# Altium schematic sheet ECG_PWR_MGMT.SchDoc: ECG power mgmt
size 420 x 297 mm; Author: Senuda Rathnayake; SheetNumber: 1; SheetTotal: 6
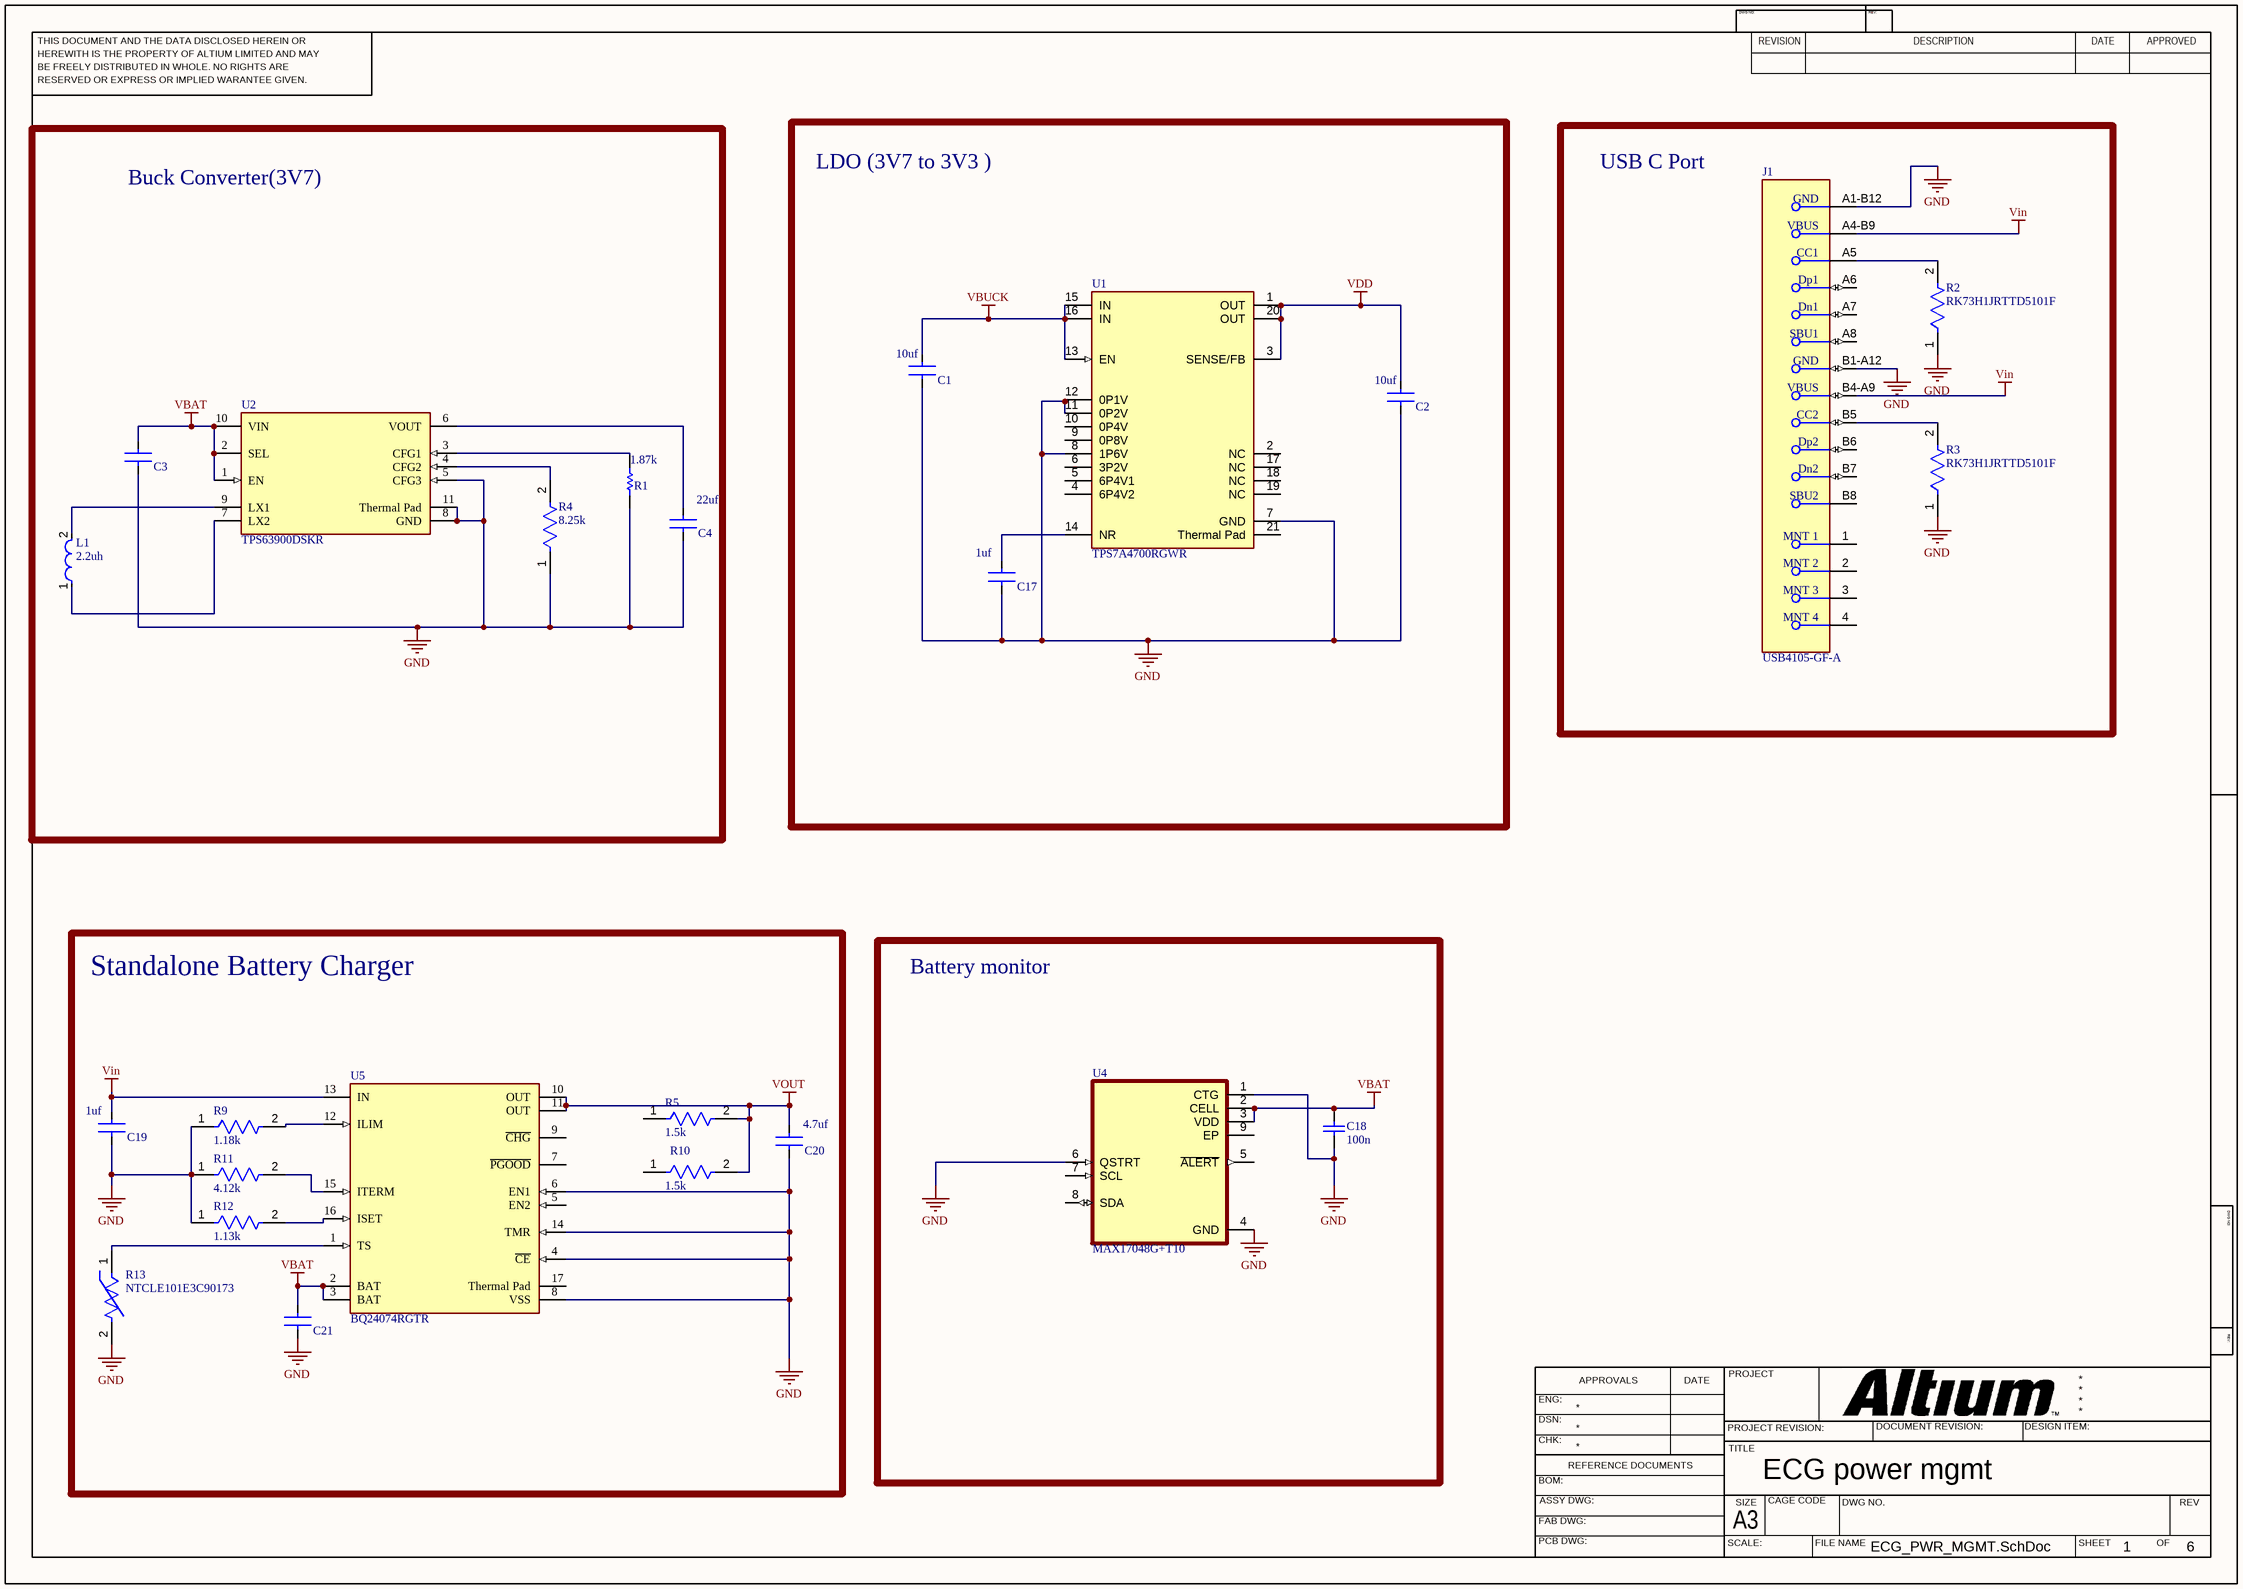
[diagram p0: ECG_PWR_MGMT.SchDoc]

## Parts
C1  10uf
C2  10uf
C3  Template for SMD cap  (value not drawn)
C4  22uf
C17  1uf
C18  100n  [CAP_SMD_0603_IPC_A]
C19  1uf
C20  4.7uf
C21  Template for SMD cap  (value not drawn)
J1  USB4105-GF-A  [FP-USB4105-GF-A-MFG]
L1  2.2uh  [FP-LQM2HPN_G0-IPC_C]
R1  1.87k  [RESC2013X60X35ML10T20]
R2  RK73H1JRTTD5101F  [FP-RK73H1J-IPC_C]
R3  RK73H1JRTTD5101F  [FP-RK73H1J-IPC_C]
R4  8.25k  [FP-MCT0603-IPC_B]
R5  1.5k  [FP-MCT0603-IPC_B]
R9  1.18k  [FP-MCT0603-IPC_B]
R10  1.5k  [FP-MCT0603-IPC_B]
R11  4.12k  [FP-MCT0603-IPC_B]
R12  1.13k  [FP-MCT0603-IPC_B]
R13  NTCLE101E3C90173  [FP-NTCLE101E3C90173-MFG]
U1  TPS7A4700RGWR  [FP-RGW0020A-MFG]
U2  TPS63900DSKR  [FP-DSK0010A-IPC_C]
U4  MAX17048G+T10  [max17048g+t10]
U5  BQ24074RGTR  [FP-RGT0016C-IPC_B]

## Blocks framed on the sheet
Buck Converter(3V7): C3 C4 L1 R1 R4 U2
LDO (3V7 to 3V3 ): C1 C2 C17 U1
USB C Port: J1 R2 R3
Standalone Battery Charger: C19-C21 R5 R9-R13 U5
Battery monitor: C18 U4

## Nets
GND: C1.1 C2.1 C3.1 C4.1 C17.1 C18.1 C19.1 C20.1 C21.1 J1.A1-B12(GND) J1.B1-A12(GND) R1.1 R2.1 R3.1 R4.1 R9.1 R11.1 R12.1 R13.2 U1.7(GND) U1.8(1P6V) U1.11(0P2V) U1.12(0P1V) U2.5(CFG3) U2.8(GND) U2.11(Thermal_Pad) U4.1(CTG) U4.4(GND) U4.6(QSTRT) U5.4(~{CE}) U5.6(EN1) U5.8(VSS) U5.14(TMR)
VBAT: C3.2 C18.2 C21.2 U2.1(EN) U2.2(SEL) U2.10(VIN) U4.2(CELL) U4.3(VDD) U5.2(BAT) U5.3(BAT)
VBUCK: C1.2 U1.13(EN) U1.15(IN) U1.16(IN)
VDD: C2.2 U1.1(OUT) U1.3(SENSE/FB) U1.20(OUT)
Vin: C19.2 J1.A4-B9(VBUS) J1.B4-A9(VBUS) U5.13(IN)
VOUT: C20.2 R5.2 R10.2 U5.10(OUT) U5.11(OUT)
NetC4_2: C4.2 U2.6(VOUT)
NetC17_2: C17.2 U1.14(NR)
NetJ1_A5: J1.A5(CC1) R2.2
NetJ1_B5: J1.B5(CC2) R3.2
NetL1_1: L1.1 U2.7(LX2)
NetL1_2: L1.2 U2.9(LX1)
NetR1_2: R1.2 U2.3(CFG1)
NetR4_2: R4.2 U2.4(CFG2)
NetR9_2: R9.2 U5.12(ILIM)
NetR11_2: R11.2 U5.15(ITERM)
NetR12_2: R12.2 U5.16(ISET)
NetR13_1: R13.1 U5.1(TS)

Not connected (* = marked no-connect by the designer): J1 1(MNT_1) 2(MNT_2) 3(MNT_3) 4(MNT_4) A6(Dp1) A7(Dn1) A8(SBU1) B6(Dp2) B7(Dn2) B8(SBU2); R5 1; R10 1; U1 2(NC) 4(6P4V2) 5(6P4V1) 6(3P2V) 9(0P8V) 10(0P4V) 17(NC) 18(NC) 19(NC) 21(Thermal_Pad); U4 5(~{ALERT}) 7(SCL) 8(SDA) 9(EP); U5 5(EN2) 7(~{PGOOD}) 9(~{CHG}) 17(Thermal_Pad)

## Notes on the sheet
- THIS DOCUMENT AND THE DATA DISCLOSED HEREIN OR
- HEREWITH IS THE PROPERTY OF ALTIUM LIMITED AND MAY
- DWG NO:
- REVISION
- REV:
- DESCRIPTION
- DATE
- APPROVED
- BE FREELY DISTRIBUTED IN WHOLE. NO RIGHTS ARE
- RESERVED OR EXPRESS OR IMPLIED WARANTEE GIVEN.
- ENG:
- APPROVALS
- PROJECT
- DSN:
- CHK:
- REFERENCE DOCUMENTS
- PROJECT REVISION:
- TITLE
- DOCUMENT REVISION:
- DESIGN ITEM:
- BOM:
- FAB DWG:
- PCB DWG:
- ASSY DWG:
- SCALE:
- A3
- SIZE
- CAGE CODE
- FILE NAME
- DWG NO.
- SHEET
- OF
- REV

## Library data of the parts
C1-C4 C17 C19-C21 = CAP-0805-16V-SMD-IPC_A
C18 = CAP-0603-16V-SMD: Manufacturer: AVX Interconnect / Elco; Part Number: 0603ZC103MAT2A
J1 = CMP-245163-000001-1: CONN RCPT USB2.0 TYPEC 5A; Manufacturer: GCT; Voltage Rating: 20V; Is Female: yes; Current Rating: 5/6.25/1.25/0.25A; Number Of Contacts: 16; Conn Orientation: Right Angle; Device Class L1: Connectors; Category: Conn; Lead Free: Yes; RoHS: TRUE; Temperature Range High: +85°C; Digikey Description: CONN RCPT USB2.0 TYPEC 5A; Device Class L3: unset; ComponentLink2Description: Datasheet; Manufacturer Part Number: USB4105-GF-A; Package: 0; Usb Standard: USB 2.0; Device Class L2: USB Connectors; Automotive: No; Temperature Range Low: -40°C; Height: 3.46mm; Temperature: -40°C to +85°C; Contact Material: Gold,Nickel; ComponentLink2URL: https://gct.co/files/drawings/usb4105.pdf; Octopart: https://octopart.com/usb4105-gf-a-gct-106627878
L1 = CMP-1662-00028-2: Multilayer Type Inductor for Power Lines, 1008 (2520), 2.2μH, 20%, 0.1Ω, 1.3A; Core Material: Ferrite; DC Resistance (DCR): 100mR; Test Frequency: 1MHz; Self Resonant Frequency: 40MHz; Shielding: Shielded; Depth: 2.2mm; Length: 2.5mm; Max DC Current: 1.3A; Military Standard: Not; Current Rating: 1.3A; Termination: SMD/SMT; Radiation Hardening: No; Tolerance: 20%; Height: 1.2mm; Case Code (Metric): 2520; DC Current: 1.3A; Inductance Tolerance: 20%; Packaging: Tape and Reel; Width: 2mm; REACH SVHC: No SVHC; Mount: Surface Mount; Inductance: 2.2uH; Max Operating Temperature: 125°C; Lead Free: Lead Free; Case/Package: 1008; Case Code (Imperial): 1008; Series: LQM2HP_G0; Height - Seated (Max): 0.039inch; Package Quantity: 3000; Min Operating Temperature: -55°C
R1 = 1K 0805
R2 R3 = CMP-04015-097718-1: 5.1kΩ ±1% 0.1W Chip Resistor 0603 Flat Chip (Anti-Sulfuration) AEC-Q200 Qualified; Power Rating: 100mW; Resistance: 5.1kR; Temperature Coefficient: 100ppm/°C; Voltage Rating: 75V; Packaging: Tape and Reel; Case/Package: 0603; Package Quantity: 5000; Min Operating Temperature: -55°C; Length: 1.6mm; Case Code (Metric): 1608; Tolerance: 1%; Width: 0.8mm; Termination: SMD/SMT; RoHS Compliant: Yes; Height: 0.45mm; Case Code (Imperial): 0603; Max Operating Temperature: 155°C; Weight: 7.1E-05oz
R4 R5 R9-R12 = CMP-02407-009826-1: RES SMD 100 OHM 1% 1/8W 0603; Resistance: 1.5kR; Temperature Coefficient: 25ppm/°C; Max Power Dissipation: 100mW; Voltage Rating (DC): 50V; Composition: Thin Film; Contact Plating: Tin; Lead Free: Lead Free; Length: 1.55mm; Packaging: Tape and Reel; Width: 0.033inch; Number of Terminations: 2; Case/Package: 0603; Height: 0.022inch; Mount: Surface Mount; Min Operating Temperature: -55°C; Package Quantity: 1000; Radiation Hardening: No; Power Rating: 100mW; Max Operating Temperature: 125°C; Military Standard: Not; Depth: 0.85mm
R13 = CMP-02404-000013-1: THERM NTC 10KOHM 3435K RADIAL; Max Power Dissipation: 250mW; Tolerance: 1%; Packaging: Bulk; Case/Package: Radial; Min Operating Temperature: -40°C; RoHS Compliant: Yes; Mount: Through Hole; Max Operating Temperature: 125°C
U1 = CMP-04917-000027-1: IC REG LINEAR POS ADJ 1A 20VQFN; Manufacturer: Texas Instruments; Output Type: AdjustableProgrammable; Output Voltage: 1.4-20.5V; Nominal Supply Current: 0.58-6.1mA; Max Supply Voltage: 35V; Accuracy Percentage: 1%; Standoff Height: 0mm; Min Supply Voltage: 3V; Max Junction Temp: +125°C; Number Of Outputs: 1; Dropout Voltage: 307mV; RoHS: TRUE; Automotive: No; Temperature Range Low: -40°C; Octopart: https://octopart.com/tps7a4700rgwr-texas+instruments-21221956; Digikey Description: IC REG LINEAR POS ADJ 1A 20VQFN; Temperature: -40°C to +125°C; Device Class L2: Power Management ICs; Manufacturer Part Number: TPS7A4700RGWR; Device Class L1: Integrated Circuits (ICs); Lead Free: Yes; Category: IC; Temperature Range High: +125°C; Package: RGW0020A; Output Current: 1A; ComponentLink2URL: http://www.ti.com/lit/ds/symlink/tps7a47.pdf; ComponentLink2Description: Datasheet; Mouser Description: LDO Voltage Regulators Low Noise,1A,Hi Vltg LDO Reg; Height: 1mm; Device Class L3: Voltage Regulators - Linear
U2 = CMP-04918-000700-1: 1.8-V TO 5.5-V, 75-NA IQ BUCK-BO; RoHS Compliant: Yes
U4 = MAX17048G+T10: 3ÂµA 1-Cell/2-Cell Fuel Gauge with ModelGauge; MF: Analog Devices; Package: TDFN-8 Maxim; Price: None; Check_prices: https://www.snapeda.com/parts/MAX17048G+T10/Analog+Devices/view-part/?ref=eda; Value: *; SnapEDA_Link: https://www.snapeda.com/parts/MAX17048G+T10/Analog+Devices/view-part/?ref=snap; MP: MAX17048G+T10; Availability: In Stock; Purchase-URL: https://pricing.snapeda.com/search/part/MAX17048G+T10/?ref=eda
U5 = CMP-0321-00220-3: IC LI-ION CHARGE MGMT 16-QFN; Fault Protection: Over Voltage; Max Charge Current: 1.5A; Interface: USB; Max Supply Voltage: 10.2V; Number of Cells: 1; Battery Pack Voltage: 4.2V; Min Supply Voltage: 4.35V; Battery Chemistry: LITHIUM-ION; Min Input Voltage: 4.3V; Lead Free: Lead Free; Max Operating Temperature: 125°C; RoHS Compliant: Yes; Contact Plating: Gold; Min Operating Temperature: -40°C; Weight: 0.000808oz; Package Quantity: 3000; Radiation Hardening: No; Case/Package: VQFN; Output Voltage: 4.2V; Packaging: Tape and Reel; Series: -; Output Current: 1.5A; Number of Pins: 16